# Altium schematic sheet PCIE3.SchDoc
size 420 x 297 mm; Scale: 1:1; DocumentType: Схема электрическая принципиальная; SheetNumber: 16; SheetTotal: 23; DocumentTypeShort: Э3; DocumentInvertoryNumber: ㅤ
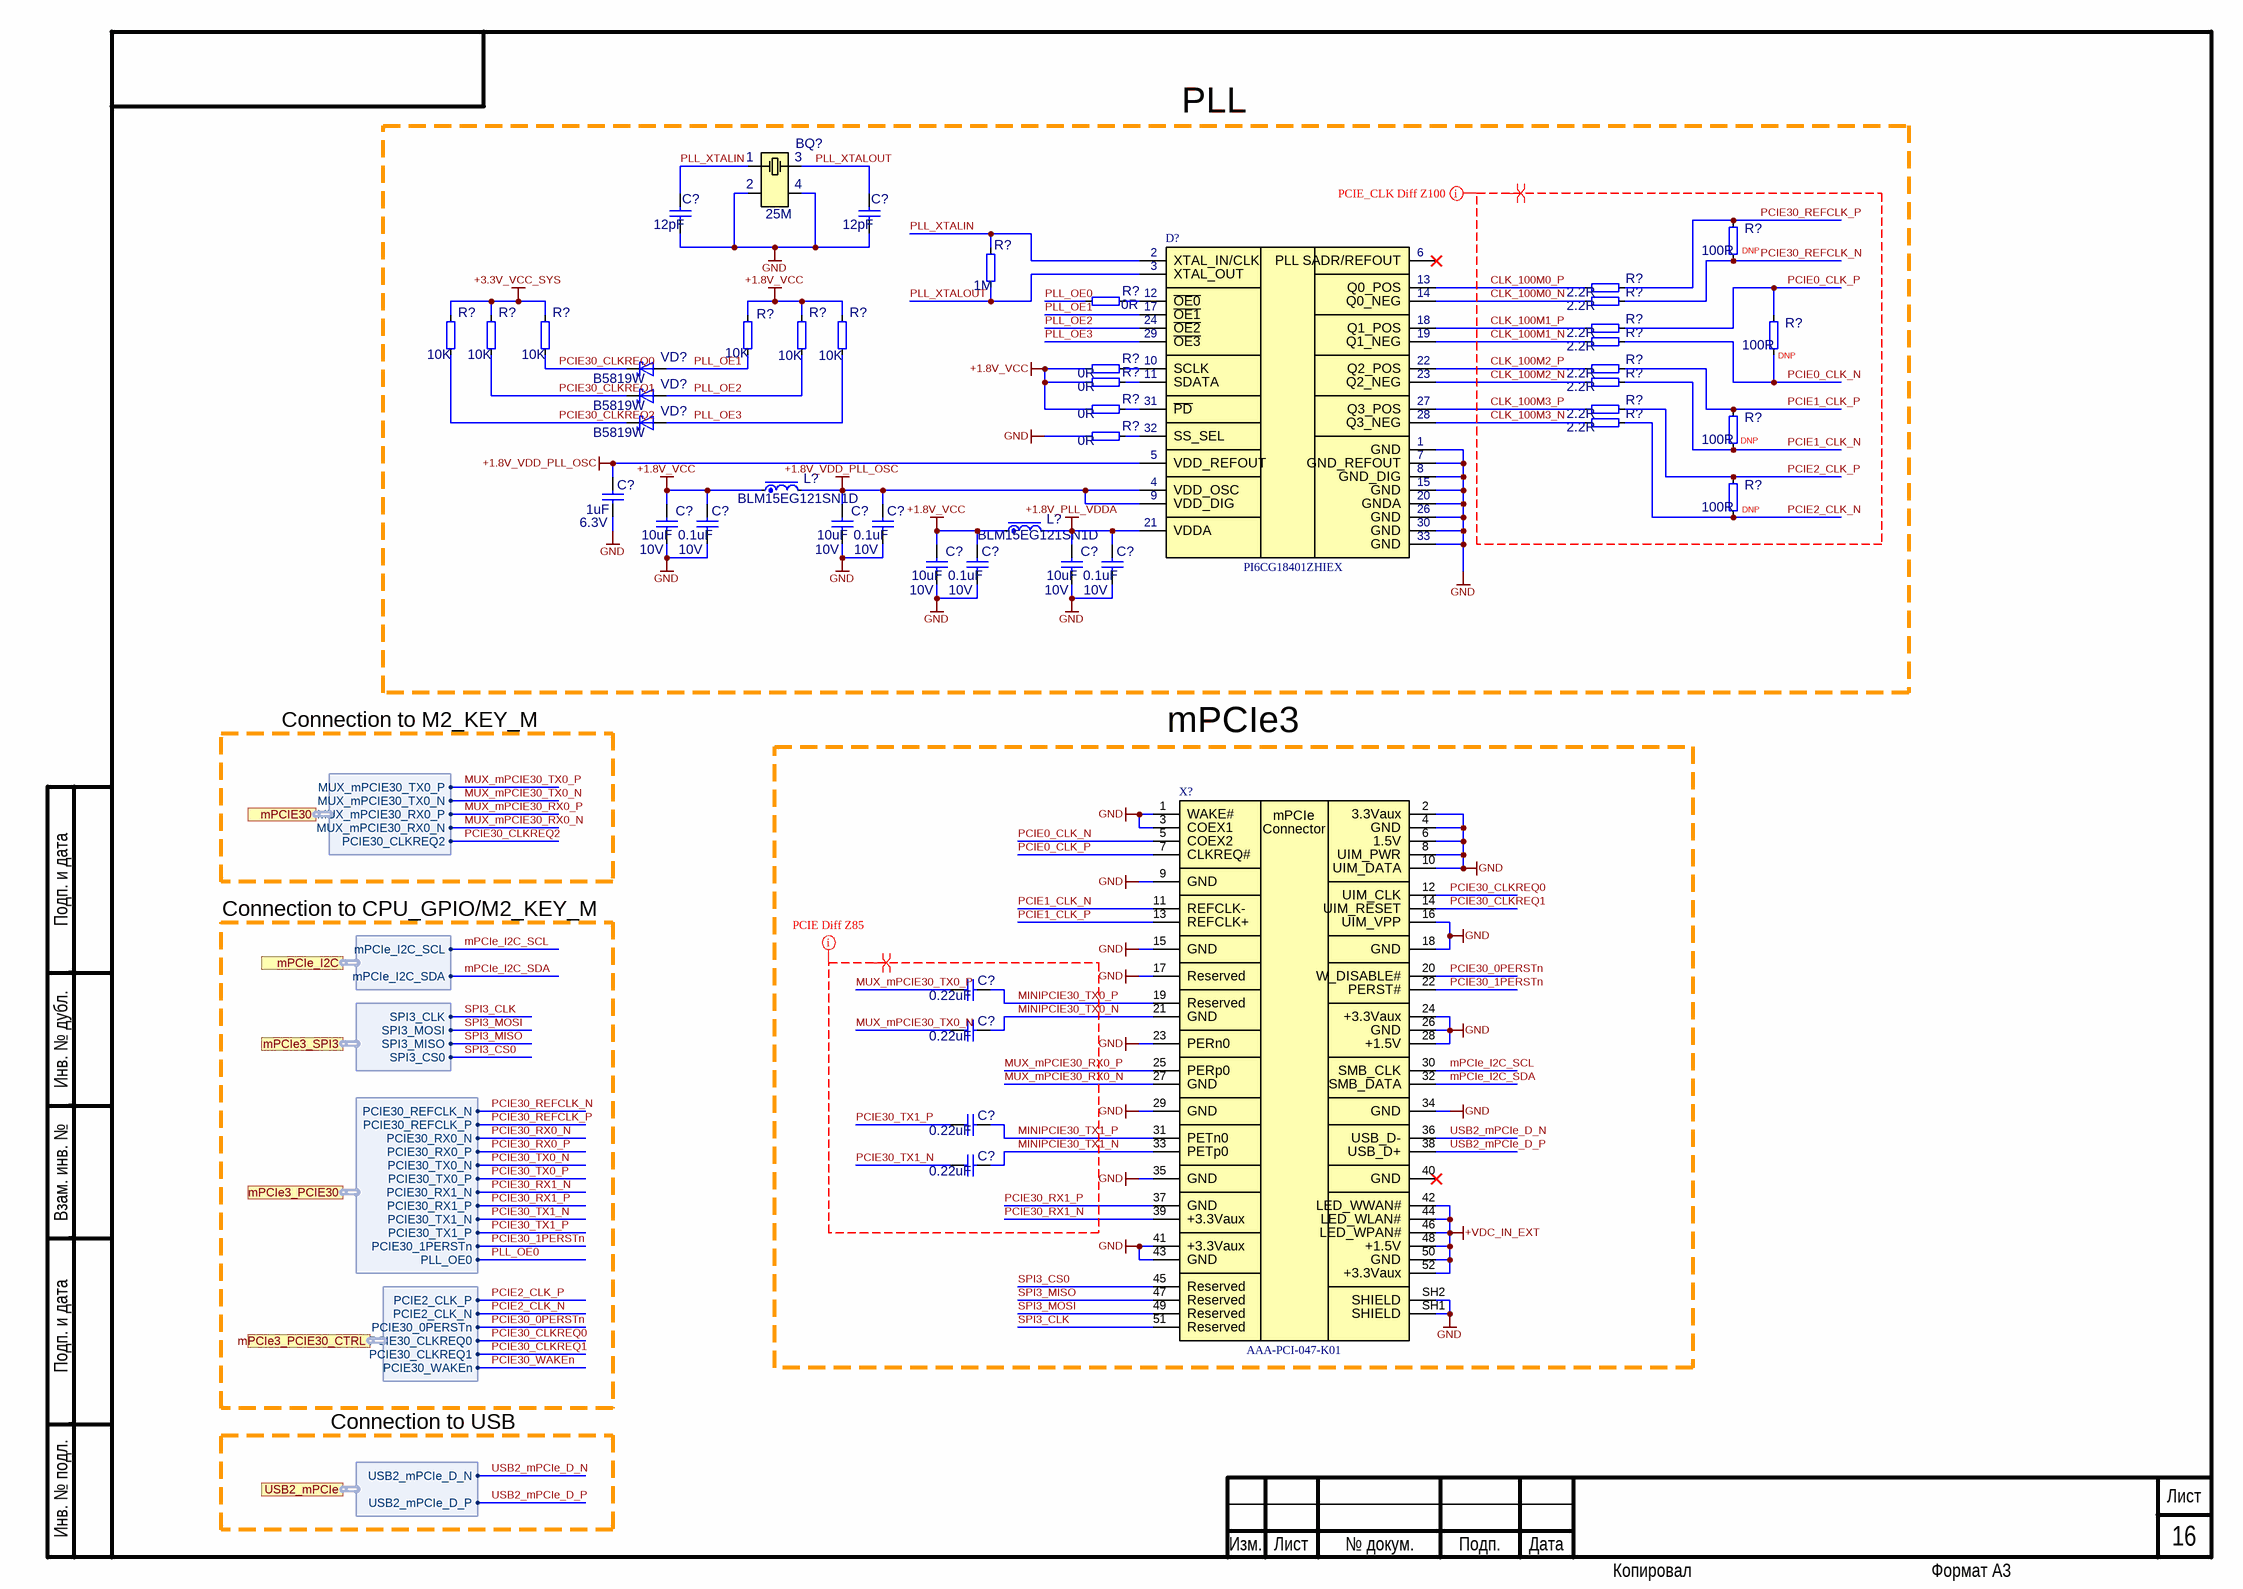
[diagram p0: PCIE3.SchDoc]

## Parts
(Parts that share a designator on the sheet are numbered #1, #2 ... from top to bottom, then left to right.)
BQ?  25M  [NX3225GA]
C?#1  12pF  [C0402]
C?#2  12pF  [C0402]
C?#3  1uF  Voltage: 6.3V  [C0402]
C?#4  10uF  Voltage: 10V  [C0402]
C?#5  0.1uF  Voltage: 10V  [C0402]
C?#6  10uF  Voltage: 10V  [C0402]
C?#7  0.1uF  Voltage: 10V  [C0402]
C?#8  10uF  Voltage: 10V  [C0402]
C?#9  0.1uF  Voltage: 10V  [C0402]
C?#10  10uF  Voltage: 10V  [C0402]
C?#11  0.1uF  Voltage: 10V  [C0402]
C?#12  0.22uF  [C0402]
C?#13  0.22uF  [C0402]
C?#14  0.22uF  [C0402]
C?#15  0.22uF  [C0402]
D?  PI6CG18401ZHIEX  [PI6CG18401ZHIEX]
L?#1  BLM15EG121SN1D  [L0402]
L?#2  BLM15EG121SN1D  [L0402]
R?#1  100R  [R_0402]
R?#2  1M  [R_0402]
R?#3  2.2R  [R_0402]
R?#4  0R  [R_0402]
R?#5  2.2R  [R_0402]
R?#6  10K  [R_0402]
R?#7  10K  [R_0402]
R?#8  10K  [R_0402]
R?#9  10K  [R_0402]
R?#10  10K  [R_0402]
R?#11  10K  [R_0402]
R?#12  2.2R  [R_0402]
R?#13  2.2R  [R_0402]
R?#14  100R  [R_0402]
R?#15  0R  [R_0402]
R?#16  2.2R  [R_0402]
R?#17  0R  [R_0402]
R?#18  2.2R  [R_0402]
R?#19  0R  [R_0402]
R?#20  2.2R  [R_0402]
R?#21  2.2R  [R_0402]
R?#22  0R  [R_0402]
R?#23  100R  [R_0402]
R?#24  100R  [R_0402]
VD?#1  B5819W  [B5819W]
VD?#2  B5819W  [B5819W]
VD?#3  B5819W  [B5819W]
X?  AAA-PCI-047-K01  [AAA-PCI-047-K01]

## Ports
mPCIe3_PCIE30 (harness mPCIe3_PCIE30), mPCIe3_PCIE30_CTRL (harness mPCIe3_PCIE30_CTRL), mPCIe3_SPI3 (harness mPCIe3_SPI3), mPCIE30 (harness mPCIE30), mPCIe_I2C (harness mPCIe_I2C), USB2_mPCIe (harness USB2_mPCIe)

## Harnesses
USB2_mPCIe: USB2_mPCIe_D_P, USB2_mPCIe_D_N
mPCIe3_SPI3: SPI3_MOSI, SPI3_CS0, SPI3_MISO, SPI3_CLK
mPCIe_I2C: mPCIe_I2C_SDA, mPCIe_I2C_SCL
mPCIE30: MUX_mPCIE30_TX0_N, MUX_mPCIE30_RX0_N, MUX_mPCIE30_RX0_P, MUX_mPCIE30_TX0_P, PCIE30_CLKREQ2
mPCIe3_PCIE30: PCIE30_REFCLK_P, PCIE30_REFCLK_N, PCIE30_RX1_P, PCIE30_RX1_N, PCIE30_TX1_N, PCIE30_TX1_P, PCIE30_RX0_P, PCIE30_RX0_N, PCIE30_TX0_N, PCIE30_TX0_P, PCIE30_1PERSTn, PLL_OE0
mPCIe3_PCIE30_CTRL: PCIE30_WAKEn, PCIE30_CLKREQ1, PCIE30_CLKREQ0, PCIE30_0PERSTn, PCIE2_CLK_N, PCIE2_CLK_P

## Nets
+1.8V_PLL_VDDA: C?#10.2 C?#11.2 D?.21(VDDA) L?#2.2
+1.8V_VCC: C?#4.2 C?#5.2 C?#8.2 C?#9.2 L?#1.1 L?#2.1 R?#9.1 R?#10.1 R?#11.1 R?#15.1 R?#17.1 R?#19.1
+1.8V_VDD_PLL_OSC: C?#3.2 C?#6.2 C?#7.2 D?.4(VDD_OSC) D?.5(VDD_REFOUT) D?.9(VDD_DIG) L?#1.2
+3.3V_VCC_SYS: R?#6.1 R?#7.1 R?#8.1
+VDC_IN_EXT: X?.42(LED_WWAN#) X?.44(LED_WLAN#) X?.46(LED_WPAN#) X?.48(+1.5V) X?.50(GND) X?.52(+3.3Vaux)
GND: BQ?.2 BQ?.4 C?#1.1 C?#2.1 C?#3.1 C?#4.1 C?#5.1 C?#6.1 C?#7.1 C?#8.1 C?#9.1 C?#10.1 C?#11.1 D?.1(GND) D?.7(GND_REFOUT) D?.8(GND_DIG) D?.15(GND) D?.20(GNDA) D?.26(GND) D?.30(GND) D?.33(GND) R?#22.1 X?.1(WAKE#) X?.2(3.3Vaux) X?.3(СОЕХ1) X?.4(GND) X?.6(1.5V) X?.8(UIM_PWR) X?.9(GND) X?.10(UIM_DATA) X?.15(GND) X?.16(UIM_VPP) X?.17(Reserved) X?.18(GND) X?.23(PERn0) X?.24(+3.3Vaux) X?.26(GND) X?.28(+1.5V) X?.29(GND) X?.34(GND) X?.35(GND) X?.41(+3.3Vaux) X?.43(GND) X?.SH1(SHIELD) X?.SH2(SHIELD)
CLK_100M0_N: D?.14(Q0_NEG) R?#5.1
CLK_100M0_P: D?.13(Q0_POS) R?#3.1
CLK_100M1_N: D?.19(Q1_NEG) R?#13.1
CLK_100M1_P: D?.18(Q1_POS) R?#12.1
CLK_100M2_N: D?.23(Q2_NEG) R?#18.1
CLK_100M2_P: D?.22(Q2_POS) R?#16.1
CLK_100M3_N: D?.28(Q3_NEG) R?#21.1
CLK_100M3_P: D?.27(Q3_POS) R?#20.1
MINIPCIE30_TX0_N: C?#13.2 X?.21(GND)
MINIPCIE30_TX0_P: C?#12.2 X?.19(Reserved)
MINIPCIE30_TX1_N: C?#15.2 X?.33(РЕТр0)
MINIPCIE30_TX1_P: C?#14.2 X?.31(PETn0)
mPCIe_I2C_SCL: X?.30(SMB_CLK) ; port mPCIe_I2C.mPCIe_I2C_SCL
mPCIe_I2C_SDA: X?.32(SMB_DATA) ; port mPCIe_I2C.mPCIe_I2C_SDA
MUX_mPCIE30_RX0_N: X?.27(GND) ; port mPCIE30.MUX_mPCIE30_RX0_N
MUX_mPCIE30_RX0_P: X?.25(PERp0) ; port mPCIE30.MUX_mPCIE30_RX0_P
MUX_mPCIE30_TX0_N: C?#13.1 ; port mPCIE30.MUX_mPCIE30_TX0_N
MUX_mPCIE30_TX0_P: C?#12.1 ; port mPCIE30.MUX_mPCIE30_TX0_P
PCIE0_CLK_N: R?#13.2 R?#14.1 X?.5(СОЕХ2)
PCIE0_CLK_P: R?#12.2 R?#14.2 X?.7(CLKREQ#)
PCIE1_CLK_N: R?#18.2 R?#23.1 X?.11(REFCLK-)
PCIE1_CLK_P: R?#16.2 R?#23.2 X?.13(REFCLK+)
PCIE2_CLK_N: R?#21.2 R?#24.1 ; port mPCIe3_PCIE30_CTRL.PCIE2_CLK_N
PCIE2_CLK_P: R?#20.2 R?#24.2 ; port mPCIe3_PCIE30_CTRL.PCIE2_CLK_P
PCIE30_0PERSTn: X?.20(W_DISABLE#) ; port mPCIe3_PCIE30_CTRL.PCIE30_0PERSTn
PCIE30_1PERSTn: X?.22(PERST#) ; port mPCIe3_PCIE30.PCIE30_1PERSTn
PCIE30_CLKREQ0: R?#8.2 VD?#1.1(K) X?.12(UIM_CLK) ; port mPCIe3_PCIE30_CTRL.PCIE30_CLKREQ0
PCIE30_CLKREQ1: R?#7.2 VD?#2.1(K) X?.14(UIM_RESET) ; port mPCIe3_PCIE30_CTRL.PCIE30_CLKREQ1
PCIE30_CLKREQ2: R?#6.2 VD?#3.1(K) ; port mPCIE30.PCIE30_CLKREQ2
PCIE30_REFCLK_N: R?#1.1 R?#5.2 ; port mPCIe3_PCIE30.PCIE30_REFCLK_N
PCIE30_REFCLK_P: R?#1.2 R?#3.2 ; port mPCIe3_PCIE30.PCIE30_REFCLK_P
PCIE30_RX0_N: port mPCIe3_PCIE30.PCIE30_RX0_N
PCIE30_RX0_P: port mPCIe3_PCIE30.PCIE30_RX0_P
PCIE30_RX1_N: X?.39(+3.3Vaux) ; port mPCIe3_PCIE30.PCIE30_RX1_N
PCIE30_RX1_P: X?.37(GND) ; port mPCIe3_PCIE30.PCIE30_RX1_P
PCIE30_TX0_N: port mPCIe3_PCIE30.PCIE30_TX0_N
PCIE30_TX0_P: port mPCIe3_PCIE30.PCIE30_TX0_P
PCIE30_TX1_N: C?#15.1 ; port mPCIe3_PCIE30.PCIE30_TX1_N
PCIE30_TX1_P: C?#14.1 ; port mPCIe3_PCIE30.PCIE30_TX1_P
PCIE30_WAKEn: port mPCIe3_PCIE30_CTRL.PCIE30_WAKEn
PLL_OE0: R?#4.1 ; port mPCIe3_PCIE30.PLL_OE0
PLL_OE1: D?.17(~{OE1}) R?#9.2 VD?#1.2(A)
PLL_OE2: D?.24(~{OE2}) R?#10.2 VD?#2.2(A)
PLL_OE3: D?.29(~{OE3}) R?#11.2 VD?#3.2(A)
PLL_XTALIN: BQ?.1 C?#1.2 D?.2(XTAL_IN/CLK) R?#2.2
PLL_XTALOUT: BQ?.3 C?#2.2 D?.3(XTAL_OUT) R?#2.1
SPI3_CLK: X?.51(Reserved) ; port mPCIe3_SPI3.SPI3_CLK
SPI3_CS0: X?.45(Reserved) ; port mPCIe3_SPI3.SPI3_CS0
SPI3_MISO: X?.47(Reserved) ; port mPCIe3_SPI3.SPI3_MISO
SPI3_MOSI: X?.49(Reserved) ; port mPCIe3_SPI3.SPI3_MOSI
USB2_mPCIe_D_N: X?.36(USB_D-) ; port USB2_mPCIe.USB2_mPCIe_D_N
USB2_mPCIe_D_P: X?.38(USB_D+) ; port USB2_mPCIe.USB2_mPCIe_D_P
NetD?_10: D?.10(SCLK) R?#15.2
NetD?_11: D?.11(SDATA) R?#17.2
NetD?_12: D?.12(~{OE0}) R?#4.2
NetD?_31: D?.31(~{PD}) R?#19.2
NetD?_32: D?.32(SS_SEL) R?#22.2

Not connected (* = marked no-connect by the designer): D? 6(SADR/REFOUT)*; X? 40(GND)*

## Layout directives
differential pair: CLK_100M0_N, CLK_100M0_P, CLK_100M1_N, CLK_100M1_P, CLK_100M2_N, CLK_100M2_P, CLK_100M3_N, CLK_100M3_P, MINIPCIE30_TX0_N, MINIPCIE30_TX0_P, MINIPCIE30_TX1_N, MINIPCIE30_TX1_P, MUX_mPCIE30_RX0_N, MUX_mPCIE30_RX0_P, MUX_mPCIE30_TX0_N, MUX_mPCIE30_TX0_P, PCIE0_CLK_N, PCIE0_CLK_P, PCIE1_CLK_N, PCIE1_CLK_P, PCIE2_CLK_N, PCIE2_CLK_P, PCIE30_REFCLK_N, PCIE30_REFCLK_P, PCIE30_RX1_N, PCIE30_RX1_P, PCIE30_TX1_N, PCIE30_TX1_P
rule Differential Pairs Routing [Pref Gap = 0.127mm    Min Gap  = 0.127mm    Max Gap  = 0.127mmPref Width = 0.12mm    Min Width  = 0.12mm    Max Width  = 0.14mm]; net class PCIE_Z85: MINIPCIE30_TX0_N, MINIPCIE30_TX0_P, MINIPCIE30_TX1_N, MINIPCIE30_TX1_P, MUX_mPCIE30_RX0_N, MUX_mPCIE30_RX0_P, MUX_mPCIE30_TX0_N, MUX_mPCIE30_TX0_P, PCIE30_RX1_N, PCIE30_RX1_P, PCIE30_TX1_N, PCIE30_TX1_P
rule Differential Pairs Routing [Pref Gap = 0.2mm    Min Gap  = 0.127mm    Max Gap  = 0.24mmPref Width = 0.11mm    Min Width  = 0.1mm    Max Width  = 0.12mm]; net class PCIE_CLK: CLK_100M0_N, CLK_100M0_P, CLK_100M1_N, CLK_100M1_P, CLK_100M2_N, CLK_100M2_P, CLK_100M3_N, CLK_100M3_P, PCIE0_CLK_N, PCIE0_CLK_P, PCIE1_CLK_N, PCIE1_CLK_P, PCIE2_CLK_N, PCIE2_CLK_P, PCIE30_REFCLK_N, PCIE30_REFCLK_P

## Notes on the sheet
- PLL
- (near R?#1) DNP
- (near R?#14) DNP
- (near R?#23) DNP
- (near R?#24) DNP
- Connection to M2_KEY_M
- mPCIe3
- Connection to CPU_GPIO/M2_KEY_M
- Connection to USB
- Подп. и дата
- Инв. № дубл.
- Взам. инв. №
- Инв. № подл.
- Изм.
- Лист
- № докум.
- Подп.
- Дата
- Копировал
- Формат А3
- (in symbol AAA-PCI-047-K01) mPCIe; Connector
- (in symbol PI6CG18401ZHIEX) PLL

## Library data of the parts
BQ? = E3SB25E00000DE: 25MHz 10pF ±10ppm SMD3225-4P; Part Number: TAXM25M4RDBCCT2T; Manufacturer: Yajingxin; Place: S; Check: False; Value: 25M; Tolerance: 10ppm; NameFromManufacturer: TAXM25M4RDBCCT2T; Last changed: 18.04.2023
C?#1 C?#2 = 0402-NP0-50V-12pF±5%: Manufacturer: Murata Electronics; NameFromManufacturer: GRM1555C1H120JA01D; Place: S; Voltage: 50V; Tolerance: 5%; Check: False; Part Number: 0402-NP0-50V-12pF±5%; Value: 12pF; Temperature: -55°C~125°C; ComponentLink2Description: Link to datasheet; ComponentLink1Description: DATASHEET; ComponentLink2URL: https://www.terraelectronica.ru/pdf/show?pdf_file=http%253A%252F%252Fwww.farnell.com%252Fdatasheets%252F2048662.pdf; ComponentLink1URL: Datasheets/capacitors/GRM1555C1H120JA01-01A.pdf; Last changed: 27.10.2022
C?#3 = 0402-X7R-6.3V-1uF±10%: Manufacturer: Yageo; NameFromManufacturer: CC0402KRX7R5BB105; Place: S; Tolerance: 10%; Check: False; Part Number: 0402-X7R-6.3V-1uF±10%; Value: 1uF; Temperature: -55°C~125°C; ComponentLink2Description: Link to datasheet; ComponentLink1Description: DATASHEET; ComponentLink2URL: https://www.terraelectronica.ru/product/1352679; ComponentLink1URL: Datasheets/capacitors/UPY-GPHC_X7R_6.3V-to-50V_20.pdf; Last changed: 27.10.2022
C?#4 C?#6 C?#8 C?#10 = 0402-X5R-10V-10uF±20: *; Manufacturer: Samsung; NameFromManufacturer: CL05A106MP5NUNC; Place: S; Tolerance: 20%; Check: False; Part Number: 0402-X5R-10V-10uF±20; Value: 10uF; Temperature: -55°C~85°C; ComponentLink2Description: Link to datasheet; ComponentLink1Description: DATASHEET; Last changed: 06.04.2023
C?#5 C?#7 C?#9 C?#11 = 0402-X7R-16V-0.1uF±10%: Part Number: 0402-X5R-10V-0.1uF±10%; Manufacturer: Yageo; NameFromManufacturer: CC0402KRX5R6BB104; Place: S; Tolerance: 10%; Check: False; Value: 0.1uF; Temperature: -55°C~125°C; ComponentLink2Description: Link to datasheet; ComponentLink1Description: DATASHEET; Last changed: 27.10.2022
C?#12-C?#15 = 0402-X5R-6.3V-0.22uF±10%: Manufacturer: Yageo; NameFromManufacturer: CC0402KRX5R5BB224; Place: S; Voltage: 6.3V; Tolerance: 10%; Check: False; Part Number: 0402-X5R-6.3V-0.22uF±10%; Value: 0.22uF; Temperature: -55°C~125°C; ComponentLink2Description: Link to datasheet; ComponentLink1Description: DATASHEET; ComponentLink2URL: https://www.digikey.com/en/products/detail/yageo/CC0402KRX5R5BB224/5195090?s=N4IgTCBcDaIMJwAwBZFgNICUAaBWTuAQoWGMiALoC%2BQA; ComponentLink1URL: Datasheets/capacitors/UPY-GPHC_X5R_4V-to-50V_26.pdf; Last changed: 27.10.2022
D? = PI6CG18401ZHIEX: Clock Generator 25MHz-IN 100MHz-OUT 32-Pin TQFN EP T/R; Manufacturer: Diodes Incorporated; Check: False; Part Number: PI6CG18401ZHIEX; NameFromManufacturer: PI6CG18401ZHIEX; Value: PI6CG18401ZHIEX
L?#1 L?#2 = BLM15EG121SN1D: 120Ω@100MHz  Ferrite Beads; Manufacturer: Murata Electronics; Place: S; Tolerance: 25%; DC Resistance: 0.095R; Check: False; Analog: UPZ1005D121-1R3TF, CBW100505U121T; Part Number: BLM15EG121SN1D; Value: BLM15EG121SN1D; Temperature: -40°C~85°C; NameFromManufacturer: BLM15EG121SN1D; Last changed: 18.04.2023
R?#1 R?#14 R?#23 R?#24 = 0402-0.0625W-100R-100ppm±1%: NameFromManufacturer: RC0402FR-07100RL; Manufacturer: Yageo; Place: S; Tolerance: 1%; Check: False; Part Number: 0402-0.0625W-100R-100ppm±1%; Value: 100R; Temperature: -55°C~155°C; ComponentLink1Description: DATASHEET; ComponentLink1URL: https://www.yageo.com/upload/media/product/productsearch/datasheet/rchip/PYu-RC_Group_51_RoHS_L_11.pdf; Datasheet: Datasheets/resistors/PYu-RC_Group_51_RoHS_L_11.pdf; Last changed: 27.10.2022
R?#2 = 0402-0.0625W-1M-100ppm±1%: NameFromManufacturer: RC0402FR-071ML; Manufacturer: Yageo; Place: S; Tolerance: 1%; Check: False; Part Number: 0402-0.0625W-1M-100ppm±1%; Value: 1M; Temperature: -55°C~155°C; ComponentLink1Description: DATASHEET; ComponentLink1URL: https://www.yageo.com/upload/media/product/productsearch/datasheet/rchip/PYu-RC_Group_51_RoHS_L_11.pdf; Datasheet: Datasheets/resistors/PYu-RC_Group_51_RoHS_L_11.pdf; Last changed: 27.10.2022
R?#3 R?#5 R?#12 R?#13 R?#16 R?#18 R?#20 R?#21 = 0402-0.0625W-0R-100ppm±1%: Part Number: 0402-0.0625W-2.2R-100ppm±1%; NameFromManufacturer: RC0402FR-072R2L; Manufacturer: Yageo; Place: S; Tolerance: 1%; Check: False; Value: 2.2R; Temperature: -55°C~155°C; ComponentLink1Description: DATASHEET; Datasheet: Datasheets/resistors/DOC012445956.pdf; Last changed: 27.10.2022
R?#4 R?#15 R?#17 R?#19 R?#22 = 0402-0.0625W-0R-100ppm±1%: NameFromManufacturer: RC0402FR-070RL; Manufacturer: Yageo; Place: S; Tolerance: 1%; Check: False; Part Number: 0402-0.0625W-0R-100ppm±1%; Value: 0R; Temperature: -55°C~155°C; ComponentLink1Description: DATASHEET; ComponentLink1URL: https://www.chipdip.ru/product0/8000617426?ysclid=l7og5x0plo427794326; Datasheet: Datasheets/resistors/DOC012445956.pdf; Last changed: 27.10.2022
R?#6-R?#11 = 0402-0.0625W-10K-100ppm±5%: NameFromManufacturer: RC0402JR-0710KL; Manufacturer: Yageo; Place: S; Tolerance: 5%; Check: False; Part Number: 0402-0.0625W-10K-100ppm±5%; Value: 10K; Temperature: -55°C~155°C; ComponentLink1Description: DATASHEET; ComponentLink1URL: https://ru.mouser.com/ProductDetail/YAGEO/RC0402JR-0710KL?qs=%2Fha2pyFadugNN0LzwXn2qF8HRAp201xOpXu%252BapQnyvRGE%2F%252Bpr1TWjQ%3D%3D; Datasheet: Datasheets/resistors/PYu-RC_Group_51_RoHS_L_11.pdf; Last changed: 27.10.2022
VD?#1-VD?#3 = B5819W: Manufacturer: MDD; Check: False; Part Number: B5819W; Value: B5819W; NameFromManufacturer: B5819W
X? = AAA-PCI-047-K01: mPCI-E Surface Mount 52 SMD,P=0.8mm Card Edge Connectors; Manufacturer: LOTES; Place: S; Check: False; Value: AAA-PCI-047-K01; Part Number: AAA-PCI-047-K01; NameFromManufacturer: AAA-PCI-047-K01; ComponentLink1Description: DATASHEET; Last changed: 24.03.2023